# EAGLE design lpd (EAGLE 9.6.2)
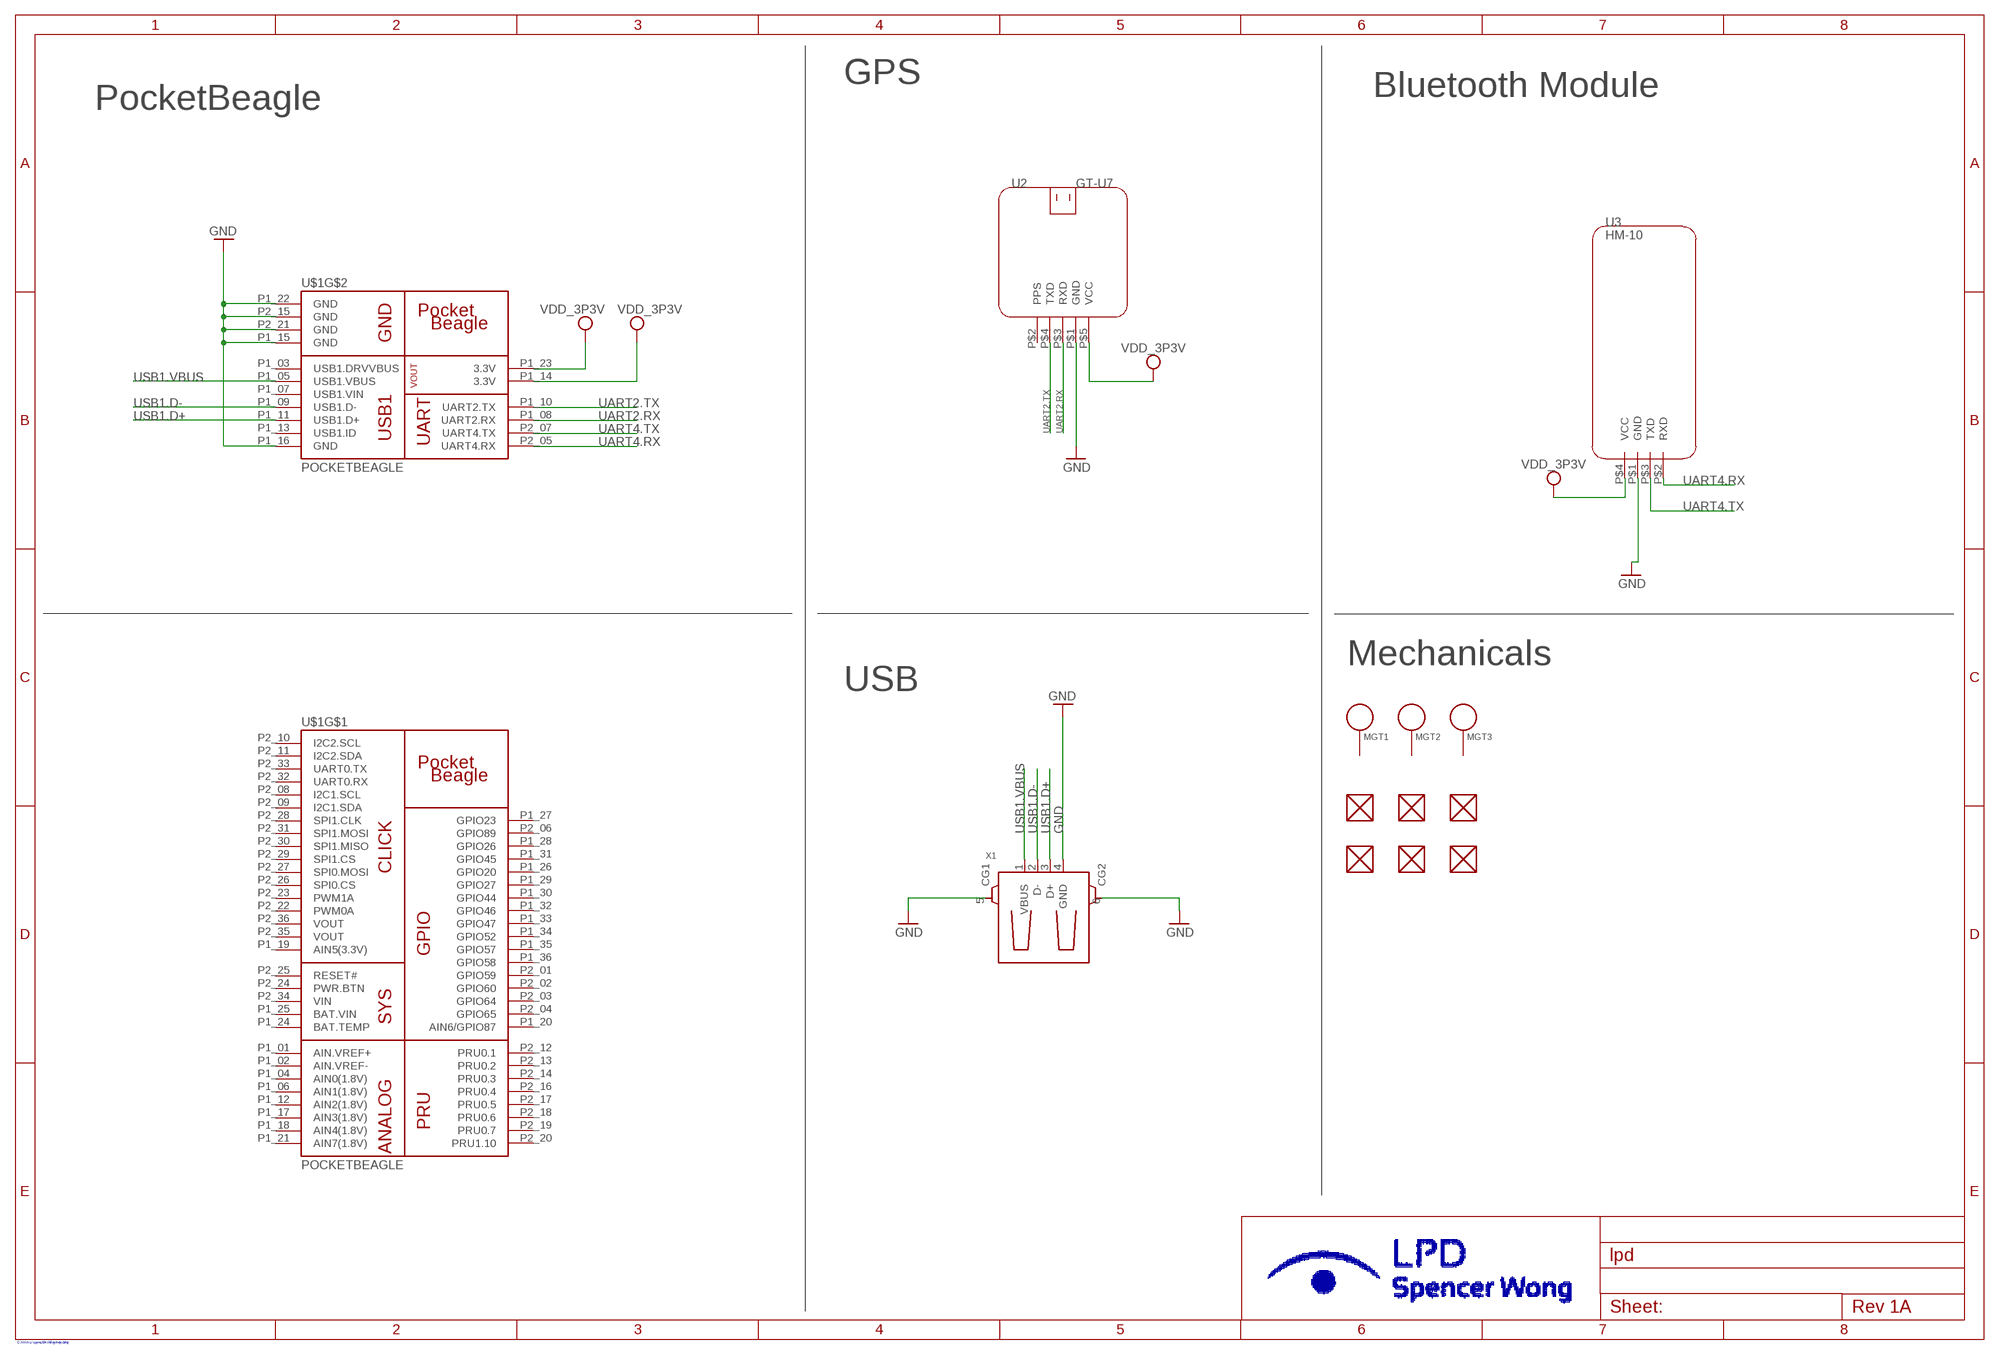
[diagram p0: schematic, sheet 1]

## Parts
FUD1  FIDUCIAL  [FIDUCIAL_40MIL]
FUD2  FIDUCIAL  [FIDUCIAL_40MIL]
FUD3  FIDUCIAL  [FIDUCIAL_40MIL]
FUD4  FIDUCIAL  [FIDUCIAL_40MIL]
FUD5  FIDUCIAL  [FIDUCIAL_40MIL]
FUD6  FIDUCIAL  [FIDUCIAL_40MIL]
MGT1  MOUNTING_HOLE  [MOUNTING_HOLE]
MGT2  MOUNTING_HOLE  [MOUNTING_HOLE]
MGT3  MOUNTING_HOLE  [MOUNTING_HOLE]
U2  GT-U7  [GPS]
U3  HM-10  [BT]
U$1  POCKETBEAGLE  [POCKETBEAGLE]
X1  GHI2_USB_HOST_W/CHASSIS_GND  [GHI2_USB_HOST_HORIZONTAL_W/CHASSIS_GND]

## Nets
GND: U2.P$1(GND) U3.P$1(GND) U$1.P1_15(GND) U$1.P1_16(GND) U$1.P1_22(GND) U$1.P2_15(GND) U$1.P2_21(GND) X1.4(GND) X1.5(CG1) X1.6(CG2)
UART2.RX: U2.P$3(RXD) U$1.P1_08(UART2.RX)
UART2.TX: U2.P$4(TXD) U$1.P1_10(UART2.TX)
UART4.RX: U3.P$2(RXD) U$1.P2_05(UART4.RX)
UART4.TX: U3.P$3(TXD) U$1.P2_07(UART4.TX)
USB1.D+: U$1.P1_11(USB1.D+) X1.3(D+)
USB1.D-: U$1.P1_09(USB1.D-) X1.2(D-)
USB1.VBUS: U$1.P1_05(USB1.VBUS) X1.1(VBUS)
VDD_3P3V: U2.P$5(VCC) U3.P$4(VCC) U$1.P1_14(3.3V) U$1.P1_23(3.3V)
Unconnected: FUD1.P$1 FUD2.P$1 FUD3.P$1 FUD4.P$1 FUD5.P$1 FUD6.P$1 MGT1.P$1 MGT2.P$1 MGT3.P$1 U2.P$2(PPS) U$1.P1_01(AIN.VREF+) U$1.P1_02(AIN.VREF-) U$1.P1_03(USB1.DRVVBUS) U$1.P1_04(AIN0(1.8V)) U$1.P1_06(AIN1(1.8V)) U$1.P1_07(USB1.VIN) U$1.P1_12(AIN2(1.8V)) U$1.P1_13(USB1.ID) U$1.P1_17(AIN3(1.8V)) U$1.P1_18(AIN4(1.8V)) U$1.P1_19(AIN5(3.3V)) U$1.P1_20(AIN6/GPIO87) U$1.P1_21(AIN7(1.8V)) U$1.P1_24(BAT.TEMP) U$1.P1_26(GPIO20) U$1.P1_27(GPIO23) U$1.P1_28(GPIO26) U$1.P1_29(GPIO27) U$1.P1_30(GPIO44) U$1.P1_31(GPIO45) U$1.P1_32(GPIO46) U$1.P1_33(GPIO47) U$1.P1_34(GPIO52) U$1.P1_35(GPIO57) U$1.P1_36(GPIO58) U$1.P2_01(GPIO59) U$1.P2_02(GPIO60) U$1.P2_03(GPIO64) U$1.P2_04(GPIO65) U$1.P2_06(GPIO89) U$1.P2_08(I2C1.SCL) U$1.P2_09(I2C1.SDA) U$1.P2_10(I2C2.SCL) U$1.P2_11(I2C2.SDA) U$1.P2_12(PRU0.1) U$1.P2_13(PRU0.2) U$1.P2_14(PRU0.3) U$1.P2_16(PRU0.4) U$1.P2_17(PRU0.5) U$1.P2_18(PRU0.6) U$1.P2_19(PRU0.7) U$1.P2_20(PRU1.10) U$1.P2_22(PWM0A) U$1.P2_23(PWM1A) U$1.P2_24(PWR.BTN) U$1.P2_25(RESET#) U$1.P2_26(SPI0.CS) U$1.P2_27(SPI0.MOSI) U$1.P2_28(SPI1.CLK) U$1.P2_29(SPI1.CS) U$1.P2_30(SPI1.MISO) U$1.P2_31(SPI1.MOSI) U$1.P2_32(UART0.RX) U$1.P2_33(UART0.TX)

## Notes on the sheet
- GPS
- Bluetooth Module
- PocketBeagle
- Mechanicals
- USB
- C:/Users/spenc/Desktop/logo.bmp

## Power pins joined to a net without a drawn wire
BAT.VIN: U$1.P1_25(BAT.VIN)
VIN: U$1.P2_34(VIN)
VOUT: U$1.P2_35(VOUT) U$1.P2_36(VOUT)

## Library data of the parts
FUD1-FUD6 = lpd:FIDUCIAL
MGT1-MGT3 = lpd:MOUNTING_HOLE: Chassis Mounting Hole w/GND connection ability
U2 = lpd:GT-U7
U3 = lpd:HM-10
U$1 = lpd:POCKETBEAGLE
X1 = lpd:GHI2_USB_HOST_W/CHASSIS_GND

## Board
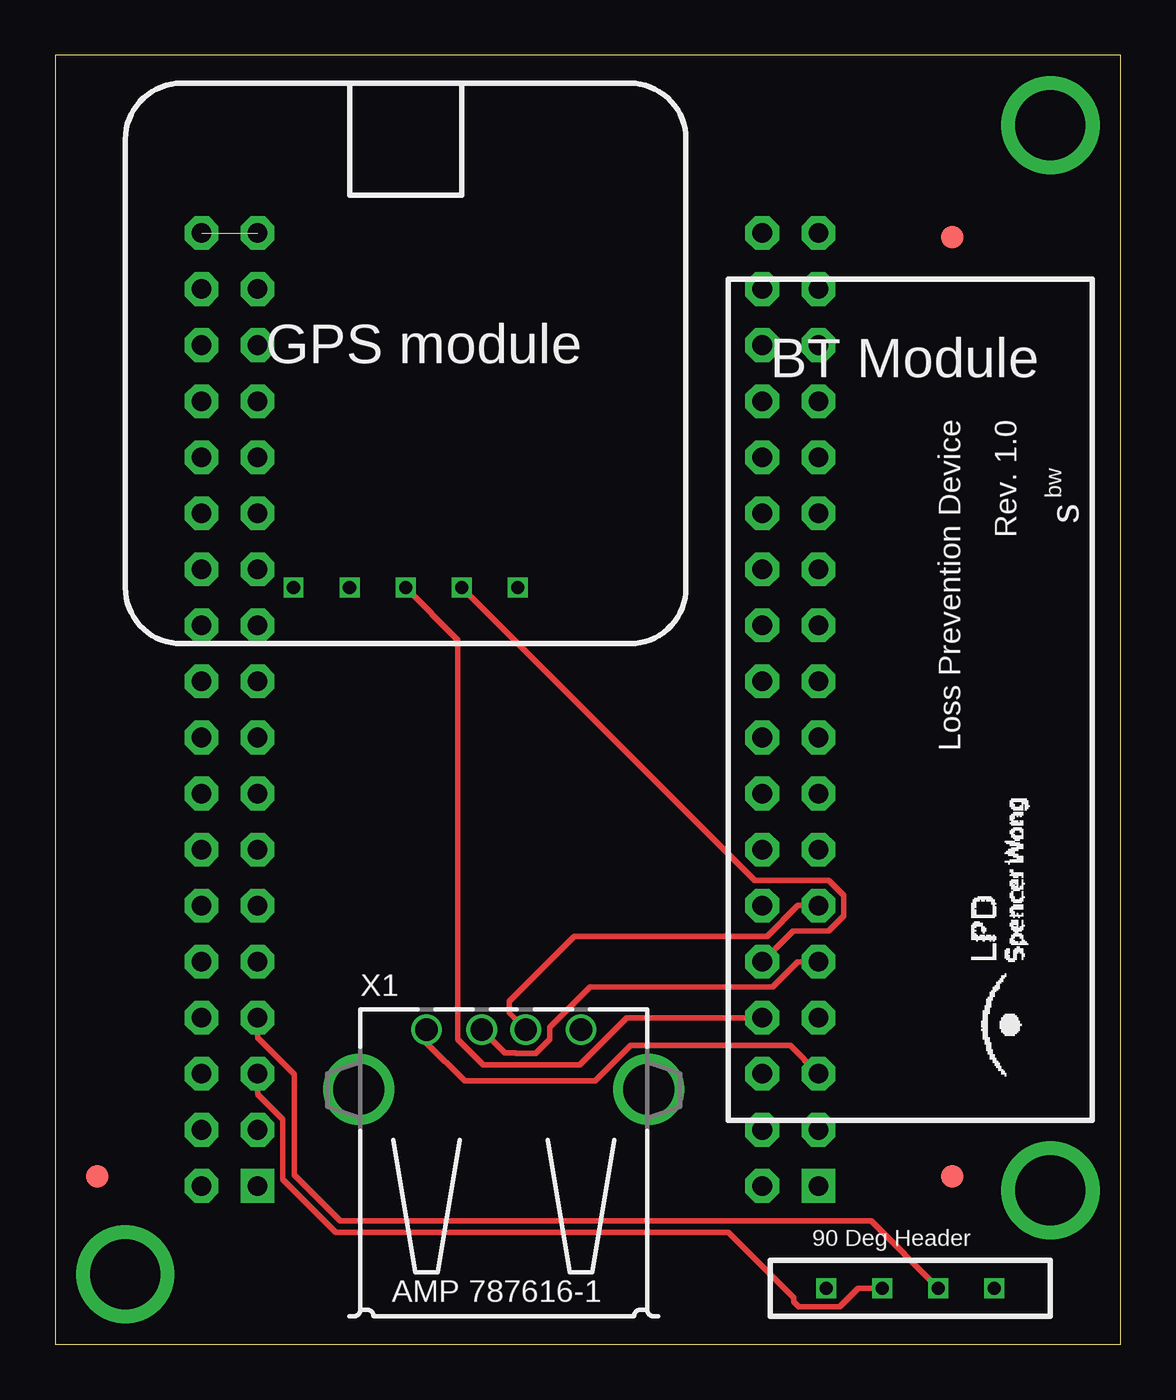
[diagram p1: board, top side]
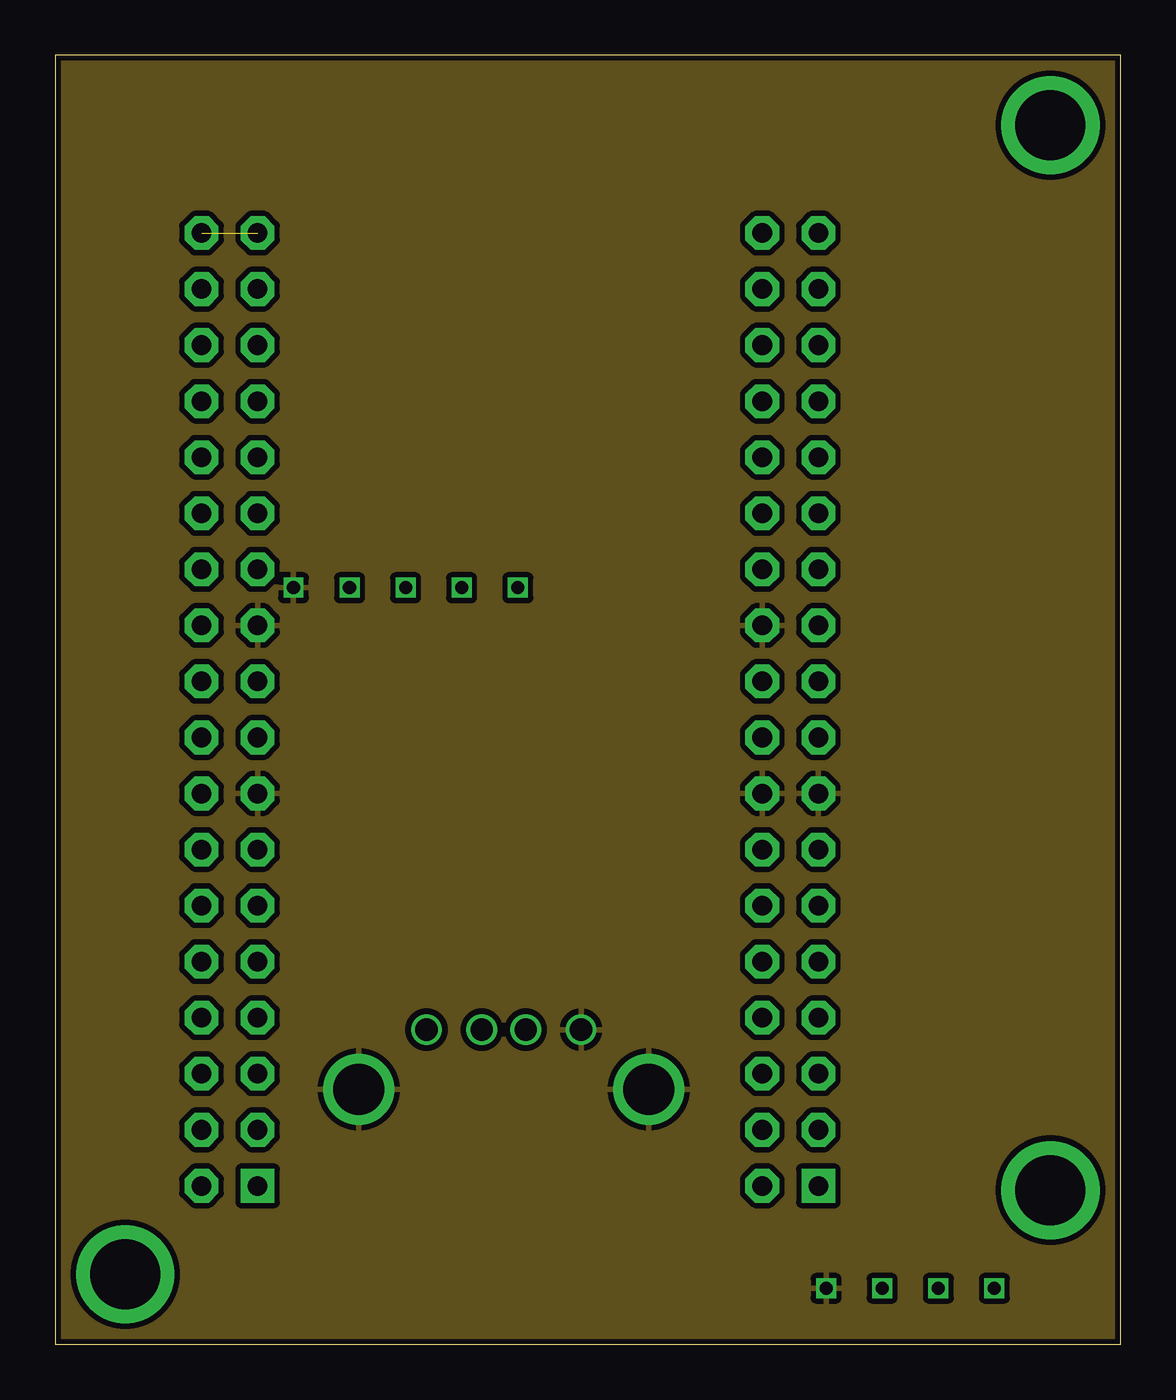
[diagram p2: board, inner layer Route2]
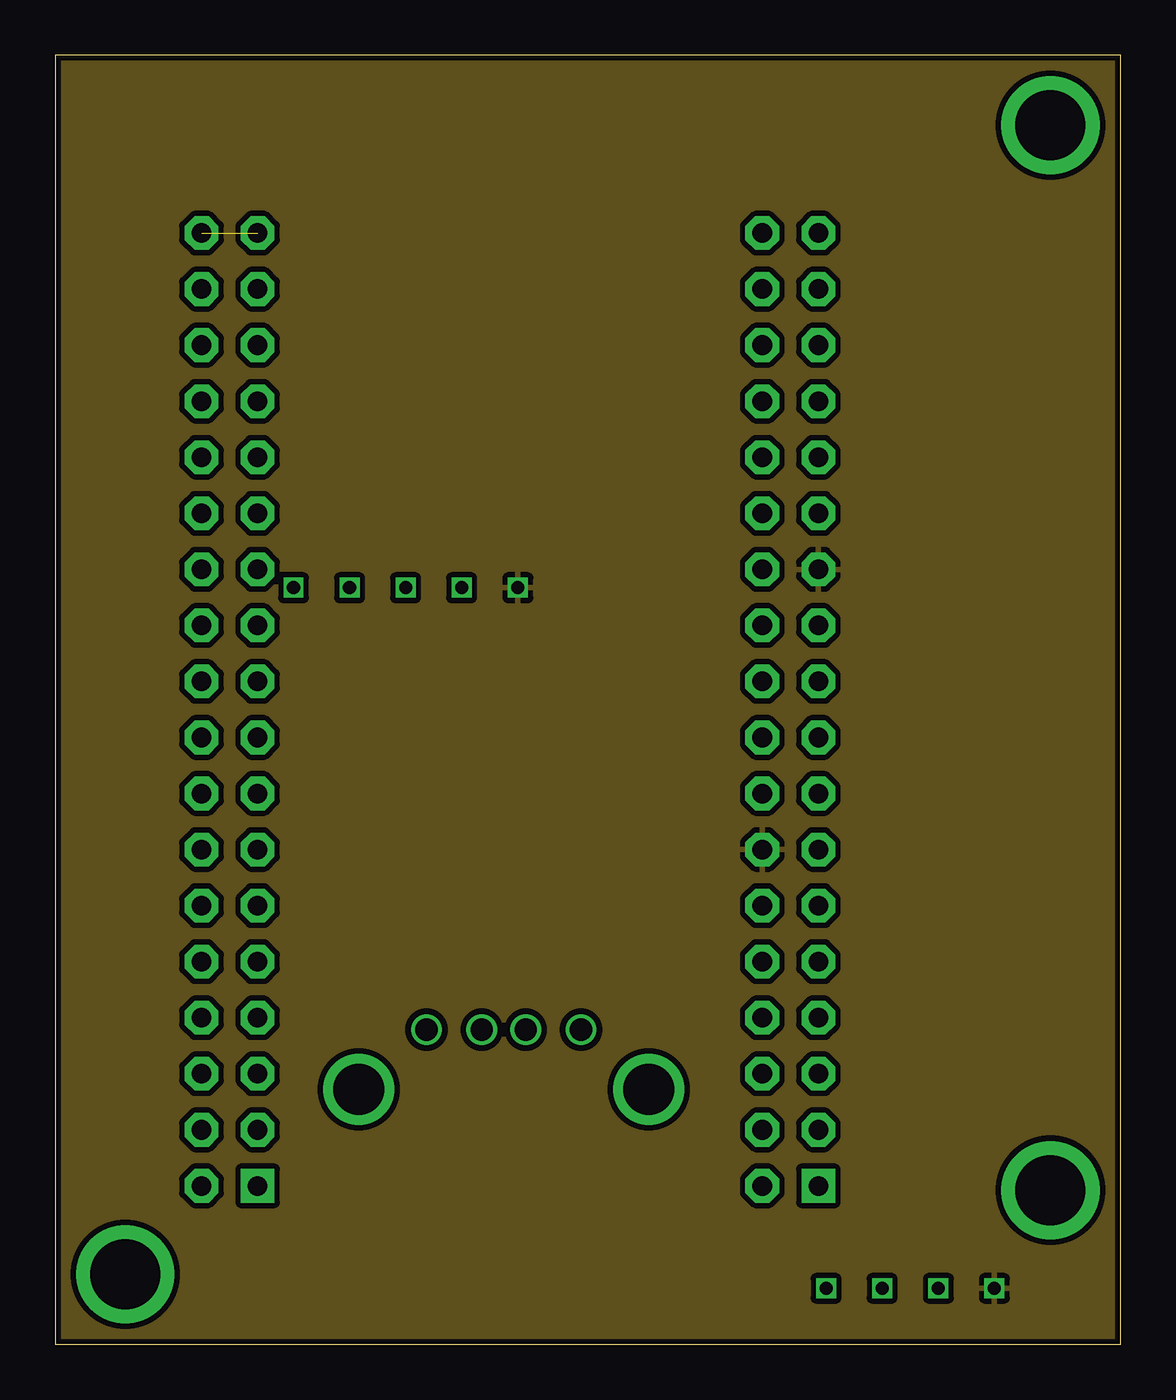
[diagram p3: board, inner layer Route15]
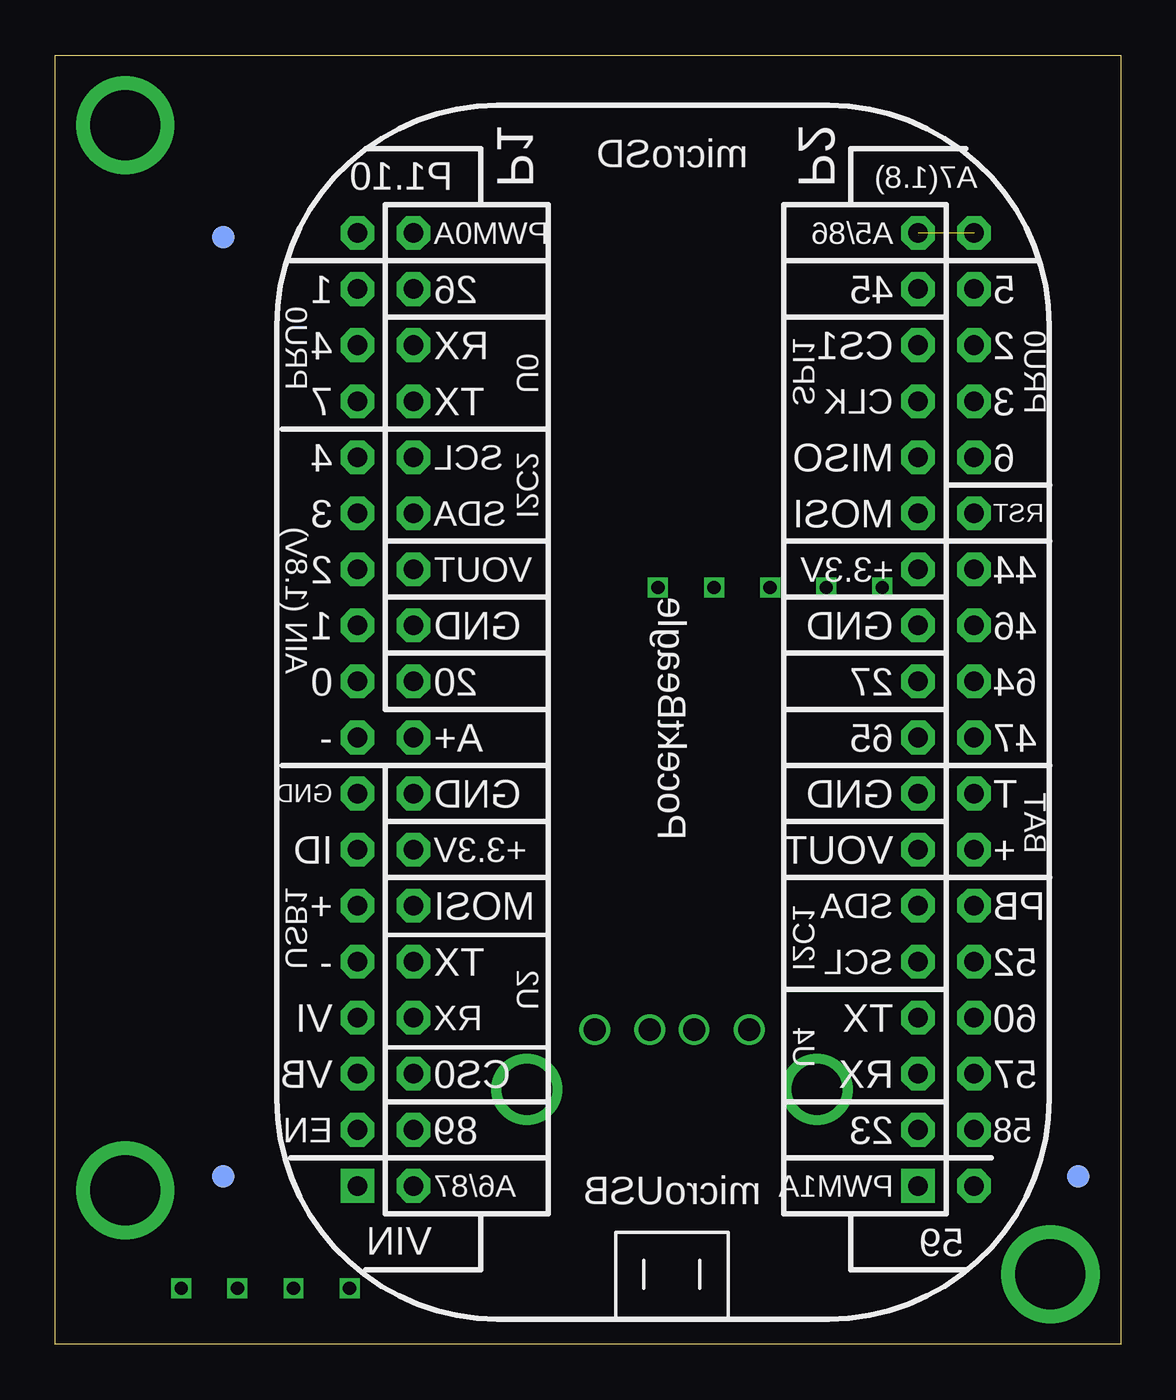
[diagram p4: board, bottom side, seen from below]

Size 48.26 x 58.42 mm. Coordinates in mm from the lower left corner, seen from the top.
Outline: 0,0 48.26,0 48.26,58.42 0,58.42 0,0
Copper layers (1*2*15*16): Top 0.035mm / dielectric 0.23mm / Route2 0.035mm / dielectric 0.93mm / Route15 0.035mm / dielectric 0.23mm / Bottom 0.035mm
Design rules "ENGI301_4lyr": minimum track width 10mil, minimum drill 12mil, track to track 10mil, track to pad 10mil, pad to pad 10mil, via to via 10mil, smd to smd 10mil, copper to edge 10mil, drill to drill 12mil, minimum pad ring 6mil, minimum via ring 6mil, stop-mask expansion 3mil, vias tented up to drill 25mil, thermal gap 10mil

### Footprints (pad centres in the part's own frame; a part is rotated, then mirrored left to right if it is on the bottom)
FIDUCIAL_40MIL = smd 1.016 x 1.016: P$1 0,0
MOUNTING_HOLE = drill 3.175 pad 4.445: P$1 0,0
GPS = drill 0.6 square: P$1 7.62,2.54; P$2 10.16,2.54; P$3 12.7,2.54; P$4 15.24,2.54; P$5 17.78,2.54
BT = drill 0.6 square: P$1 2.54,-1.27; P$2 5.08,-1.27; P$3 7.62,-1.27; P$4 10.16,-1.27
POCKETBEAGLE = drill 0.889 pad 1.524 square: P1_01 5.91,3.53; P2_01 5.91,28.93 | drill 0.889 pad 1.524 octagon: P1_02 5.91,6.07; P1_03 8.45,3.53; P1_04 8.45,6.07; P1_05 10.99,3.53; P1_06 10.99,6.07; P1_07 13.53,3.53; P1_08 13.53,6.07; P1_09 16.07,3.53; P1_10 16.07,6.07; P1_11 18.61,3.53; P1_12 18.61,6.07; P1_13 21.15,3.53; P1_14 21.15,6.07; P1_15 23.69,3.53; P1_16 23.69,6.07; P1_17 26.23,3.53; P1_18 26.23,6.07; P1_19 28.77,3.53; P1_20 28.77,6.07; P1_21 31.31,3.53; P1_22 31.31,6.07; P1_23 33.85,3.53; P1_24 33.85,6.07; P1_25 36.39,3.53; P1_26 36.39,6.07; P1_27 38.93,3.53; P1_28 38.93,6.07; P1_29 41.47,3.53; P1_30 41.47,6.07; P1_31 44.01,3.53; P1_32 44.01,6.07; P1_33 46.55,3.53; P1_34 46.55,6.07; P1_35 49.09,3.53; P1_36 49.09,6.07; P2_02 5.91,31.47; P2_03 8.45,28.93; P2_04 8.45,31.47; P2_05 10.99,28.93; P2_06 10.99,31.47; P2_07 13.53,28.93; P2_08 13.53,31.47; P2_09 16.07,28.93; P2_10 16.07,31.47; P2_11 18.61,28.93; P2_12 18.61,31.47; P2_13 21.15,28.93; P2_14 21.15,31.47; P2_15 23.69,28.93; P2_16 23.69,31.47; P2_17 26.23,28.93; P2_18 26.23,31.47; P2_19 28.77,28.93; P2_20 28.77,31.47; P2_21 31.31,28.93; P2_22 31.31,31.47; P2_23 33.85,28.93; P2_24 33.85,31.47; P2_25 36.39,28.93; P2_26 36.39,31.47; P2_27 38.93,28.93; P2_28 38.93,31.47; P2_29 41.47,28.93; P2_30 41.47,31.47; P2_31 44.01,28.93; P2_32 44.01,31.47; P2_33 46.55,28.93; P2_34 46.55,31.47; P2_35 49.09,28.93; P2_36 49.09,31.47
GHI2_USB_HOST_HORIZONTAL_W/CHASSIS_GND = drill 1: 1 -3.5,12.99; 2 -1,12.99; 3 1,12.99; 4 3.5,12.99 | drill 2.3: 5 -6.57,10.28; 6 6.57,10.28

### Placement (x,y rotation side)
FUD1  1.91,7.62 0 top
FUD2  40.64,7.62 0 top
FUD3  40.64,50.16 0 top
FUD4  1.91,7.62 0 bottom
FUD5  40.64,7.62 0 bottom
FUD6  40.64,50.16 0 bottom
MGT1  3.17,3.17 0 top
MGT2  45.09,6.99 0 top
MGT3  45.09,55.24 0 top
U2  3.17,31.75 0 top
U3  32.38,3.81 0 top
U$1  38.1,1.27 90 top
X1  20.32,1.27 0 top

### Tracks (layer width: path | path; a pad name or v marks a point on that pad's centre or on a via)
GND
  pour Route2: -2.54,60.96 50.8,60.96 50.8,-2.54 -2.54,-2.54
UART2.RX
  Top 0.254: U2.P$3 18.24,31.93 18.24,13.81 19.38,12.67 23.76,12.67 25.89,14.8 U$1.P1_08
UART2.TX
  Top 0.254: U2.P$4 31.68,21.02 35.04,21.02 35.71,20.35 35.71,19.41 35.04,18.74 33.43,18.74 U$1.P1_10
UART4.RX
  Top 0.254: U3.P$2 36.37,2.54 35.53,1.71 33.68,1.71 33.46,1.93 33.46,2.1 30.48,5.08 12.7,5.08 10.31,7.47 10.31,10.19 9.17,11.34 U$1.P2_05
UART4.TX
  Top 0.254: U3.P$3 36.96,5.59 12.91,5.59 10.82,7.68 10.82,12.22 9.17,13.88 U$1.P2_07
USB1.D+
  Top 0.254: U$1.P1_11 33.65,19.88 32.25,18.48 23.51,18.48 20.56,15.53 20.56,15.02 X1.3
USB1.D-
  Top 0.254: U$1.P1_09 33.65,17.34 32.5,16.2 24.23,16.2 22.4,14.37 22.4,13.81 21.77,13.18 20.87,13.18 20.84,13.21 20.37,13.21 X1.2
USB1.VBUS
  Top 0.254: U$1.P1_05 33.29,13.54 26.07,13.54 24.46,11.94 18.54,11.94 16.82,13.66 X1.1
VDD_3P3V
  pour Route15: -5.08,63.5 -5.08,-5.08 53.34,-5.08 53.34,63.5
VOUT  (1 unrouted)

### Text on the board
tPlace: Loss Prevention Device | Rev. 1.0 | s | bw